# Altium schematic sheet LM-CT-001.SchDoc
size Tabloid
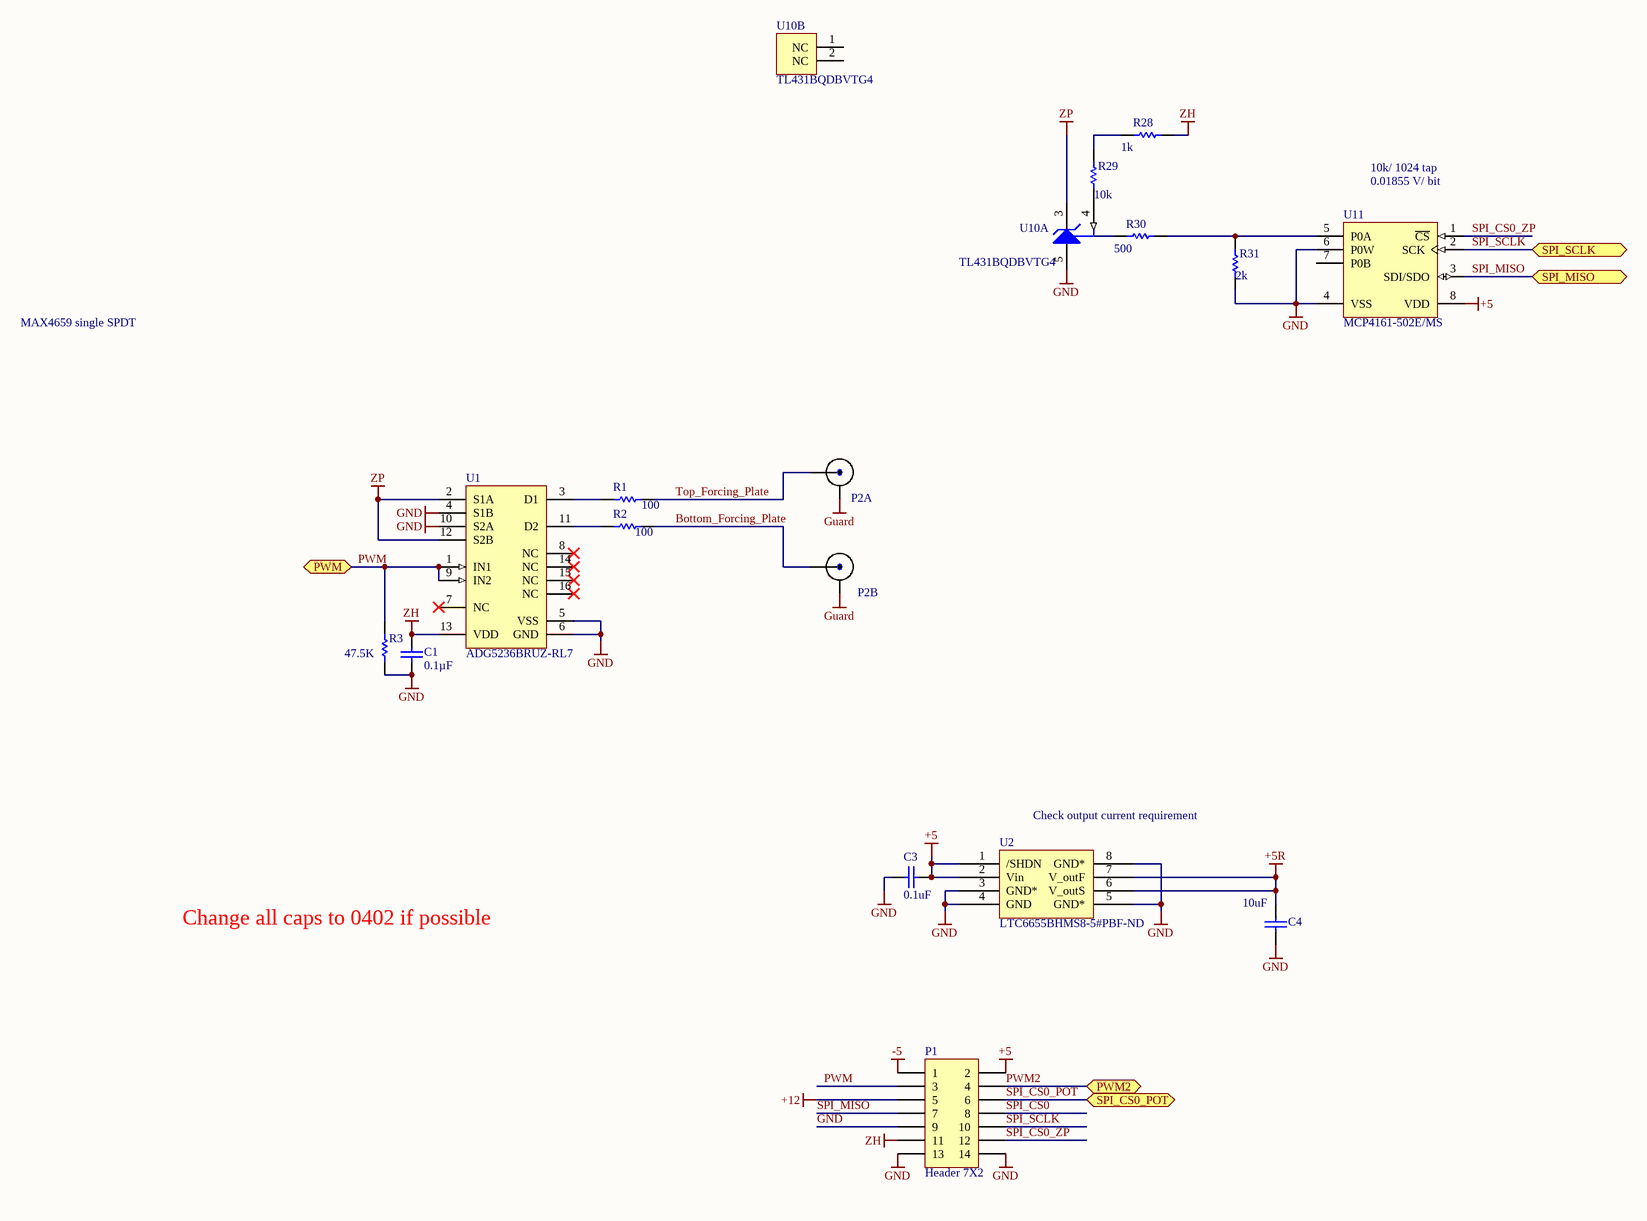
[diagram p0: LM-CT-001.SchDoc]

## Parts
C1  Capacitance: 0.1µF  [CAPC0805(2012)145_N]  (hidden comment: CAP CER 0.1UF 25V X7R 0805)
C3  0.1uF  [CAPC0402(1005)60_L]
C4  value 10uF  [CAPC1812(4532)250_N]  (hidden comment: CAP FILM 10UF 20% 16VDC 1812)
P1  Header 7X2  [FTSH-107-01-F-D-K]
P2  GRF1-P-P-04-E-ST-TH1  [GRF1-P-P-04-E-ST-TH1]  (value not drawn)  (parts A,B of 4)
R1  100  [RESC0402(1005)_M]
R2  100  [RESC0402(1005)_M]
R3  47.5K  [RESC0402(1005)_M]
R28  1k  [RESC0402(1005)_M]
R29  10k  [RESC0402(1005)_M]
R30  500  [RESC0402(1005)_M]
R31  2k  [RESC0402(1005)_M]
U1  ADG5236BRUZ-RL7  [ADI-RU-16_L]
U2  Supplier Part Number 1: LTC6655BHMS8-5#PBF-ND  [TSOP65P490X110-8N]  (hidden comment: LTC6655BHMS8-5#PBF)
U10  TL431BQDBVTG4  [TI-DBV5_N]  (parts A,B of 2)
U11  MCP4161-502E/MS  [MSOP-MS8_N]

## Ports
PWM, PWM2, SPI_CS0_POT, SPI_MISO, SPI_SCLK

## Nets
+5: C3.2 P1.2 U2.1(/SHDN) U2.2(Vin) U11.8(VDD)
+5R: C4.2 U2.6(V_outS) U2.7(V_outF)
+12: P1.5
-5: P1.1
GND: C1.1 C3.1 C4.1 P1.9 P1.13 P1.14 R3.2 R31.2 U1.4(S1B) U1.5(VSS) U1.6(GND) U1.10(S2A) U2.3(GND*) U2.4(GND) U2.5(GND*) U2.8(GND*) U10.5(ANODE) U11.4(VSS) U11.6(P0W)
Guard: P2.7 P2.8
ZH: C1.2 P1.11 R28.2 U1.13(VDD)
ZP: U1.2(S1A) U1.12(S2B) U10.3(CATHODE)
Bottom_Forcing_Plate: P2.2 R2.1
PWM: P1.3 R3.1 U1.1(IN1) U1.9(IN2) ; port PWM
PWM2: P1.4 ; port PWM2
SPI_CS0: P1.8
SPI_CS0_POT: P1.6 ; port SPI_CS0_POT
SPI_CS0_ZP: P1.12 U11.1(~{CS})
SPI_MISO: P1.7 U11.3(SDI/SDO) ; port SPI_MISO
SPI_SCLK: P1.10 U11.2(SCK) ; port SPI_SCLK
Top_Forcing_Plate: P2.1 R1.1
NetR1_2: R1.2 U1.3(D1)
NetR2_2: R2.2 U1.11(D2)
NetR28_1: R28.1 R29.1
NetR29_2: R29.2 U10.4(REF)
NetR30_2: R30.2 R31.1 U11.5(P0A)

Not connected (* = marked no-connect by the designer): R30 1; U1 7(NC)* 8(NC)* 14(NC)* 15(NC)* 16(NC)*; U10 1(NC) 2(NC); U11 7(P0B)

## Notes on the sheet
- 10k/ 1024 tap
- (near U11) 0.01855 V/ bit
- MAX4659 single SPDT
- (near U2) Check output current requirement
- Change all caps to 0402 if possible
- Title
- Size:
- Date:
- Tabloid
- Number:
- Time:
- Revision:
- Sheet
- of
- ZLS Corporation
- 7801 North Lamar Blvd.
- Suite E-184
- Austin, Texas 78752  USA
- (512) 453-0288
- File:

## Library data of the parts
C1 = CMP-1036-04795-1: Manufacturer: Murata Electronics North America; Manufacturer Part Number: GRM21BR71E104KA01L; Tolerance: ±10%; Supplier 1: Digi-Key; Supplier Part Number 1: 490-1673-6-ND; RoHS: RoHS Compliant; Category: Capacitors; Stock 1: 891652; Pricing 1: 1=0.2, 10=0.145, 100=0.0683, 500=0.04788, 1000=0.03964 (USD); Packaging: Digi-Reel®; Part Status: Active; Voltage - Rated: 25V; Temperature Coefficient: X7R; Operating Temperature: -55°C ~ 125°C; Features: -; Ratings: -; Applications: General Purpose; Mounting Type: Surface Mount, MLCC; Package / Case: 0805 (2012 Metric); Size / Dimension: 0.079" L x 0.049" W (2.00mm x 1.25mm); Height - Seated (Max): -; Thickness (Max): 0.053" (1.35mm); Lead Spacing: -; Lead Style: -; ComponentLink1URL: http://www.murata.com/~/media/webrenewal/support/library/catalog/products/capacitor/mlcc/c02e.ashx; ComponentLink1Description: http://www.murata.com/~/media/webrenewal/support/library/catalog/products/capacitor/mlcc/c02e.ashx
C3 = CMP-1034-00252-1: CAP CER 0.1UF 10V X7R 0402; Manufacturer: Murata Electronics North America; Manufacturer Part Number: GRM155R71A104KA01D; Tolerance: ±10%; Supplier 1: Digi-Key; Supplier Part Number 1: 490-6321-1-ND; RoHS: RoHS Compliant; Category: Capacitors; Stock 1: 2920395; Pricing 1: 1=0.1, 10=0.014, 100=0.0063, 500=0.00446, 1000=0.00351, 2500=0.00319, 5000=0.00293 (USD); Packaging: Cut Tape (CT); Part Status: Active; Voltage - Rated: 10V; Temperature Coefficient: X7R; Operating Temperature: -55°C ~ 125°C; Features: -; Ratings: -; Applications: General Purpose; Mounting Type: Surface Mount, MLCC; Package / Case: 0402 (1005 Metric); Size / Dimension: 0.039" L x 0.020" W (1.00mm x 0.50mm); Height - Seated (Max): -; Thickness (Max): 0.022" (0.55mm); Lead Spacing: -; ComponentLink1URL: http://www.murata.com/~/media/webrenewal/support/library/catalog/products/capacitor/mlcc/c02e.ashx?la=en-us; ComponentLink1Description: http://www.murata.com/~/media/webrenewal/support/library/catalog/products/capacitor/mlcc/c02e.ashx?la=en-us
C4 = CMP-1040-01653-1: Manufacturer: Rubycon; Manufacturer Part Number: 16ST106MC44532; Rated Voltage: 16 V; Case-Metric: 4532; Case-EIA: 1812; Tolerance: Â±10%; Voltage Rating - DC: 16V; Dielectric Material: Acrylic, Metallized; Technology: SMT; Max Thickness: 2.5 mm; Supplier 1: Digi-Key; Supplier Part Number 1: 1189-1792-1-ND; RoHS: RoHS Compliant; Category: Capacitors; Stock 1: 1994; Pricing 1: 1=7.05, 10=6.263, 100=5.0105 (USD); Packaging: Cut Tape (CT); Part Status: Active; Voltage Rating - AC: -; Operating Temperature: -55°C ~ 125°C; Mounting Type: Surface Mount; Package / Case: 1812 (4532 Metric); Size / Dimension: 0.177" L x 0.126" W (4.50mm x 3.20mm); Height - Seated (Max): 0.102" (2.60mm); Lead Spacing: -; Applications: DC Link, DC Filtering; Features: -; ComponentLink1URL: http://www.rubycon.co.jp/en/catalog/e_pdfs/pmlcap/e_ST.pdf; ComponentLink1Description: http://www.rubycon.co.jp/en/catalog/e_pdfs/pmlcap/e_ST.pdf
P1 = Header 7X2: Header, 7-Pin, Dual row; LatestRevisionDate: 17-Jul-2002; LatestRevisionNote: Re-released for DXP Platform.; Publisher: Altium Limited
R1-R3 R28-R31 = CMP-1011-00463-1
U1 = CMP-0794-00019-1: High Voltage Latch-Up Proof, Dual SPDT Switches, 160 Ohm Ron, 16-pin SOP (RU-16), Reel; Manufacturer: Analog Devices; Max Pos Supply: +40V; # Sw Functions: 2; Max Neg Supply: -22V; t ON: 170ns, 150ns, 275ns, 170ns; Ron (ohms): 160, 140, 350, 150; Configuration: SPDT; PackageVersion: Nov-02; ComponentLink1Description: Manufacturer URL; ComponentLink3URL: http:/www.analog.com/static/imported-files/packages/36244347913743854010197452789RU16.pdf; PartNumber: ADG5236BRUZ-RL7; ComponentLink3Description: Package Specification; Code_JEDEC: MO-153AB; ComponentLink2Description: Datasheet; ComponentLink1URL: http://www.analog.com/en/index.html; ComponentLink2URL: http://www.analog.com/static/imported-files/data_sheets/ADG5236.pdf; Mounting Technology: Surface Mount; PackageDescription: 16-Pin Thin Shrink Small Outline Package, Body 5 x 4.4 mm, Pitch 0.65 mm; Packing: Reel; DatasheetVersion: Rev. A; PackageReference: RU-16
U2 = LTC6655BHMS8-5#PBF: Manufacturer: Linear Technology; Reference Type: Series; Output Type: Fixed; Voltage - Output (Min/Fixed): 5V; Tolerance: ±0.025%; Temperature Coefficient: 2ppm/°C; Noise - 0.1Hz to 10Hz: 0.25ppmp-p; Voltage - Input: 5.5 V ~ 13.2 V; Current - Supply: 7.5mA; Supplier 1: Digi-Key; Manufacturer Part Number: LTC6655BHMS8-5#PBF; RoHS: RoHS Compliant; Category: Integrated Circuits (ICs); Stock 1: 872; Pricing 1: 1=12.29, 25=8.158, 100=6.7 (USD); Packaging: Tube; Part Status: Active; Noise - 10Hz to 10kHz: -; Operating Temperature: -40°C ~ 125°C (TA); Mounting Type: Surface Mount; Package / Case: 8-TSSOP, 8-MSOP (0.118", 3.00mm Width); Supplier Device Package: 8-MSOP; ComponentLink1URL: http://www.linear.com/docs/28576; ComponentLink1Description: http://www.linear.com/docs/28576
U10 = CMP-0366-00713-1: Adjustable Precision Shunt Regulator, 34 ppm / degC, 100 mA, -40 to 125 degC, 5-pin SOT-23 (DBV), Green (RoHS & no Sb/Br); Manufacturer: Texas Instruments; Initial Accuracy @ 25/deg C(%): 0.5; Min Iz for Regulation(uA): 600; VO Adj(Max)(V): 36; Rating: Catalog; Temp Coeff(Typ)(ppm/ degree C): 34; VO Adj(Min)(V): 2.495; Iout/Iz(Max)(mA): 100; SubFamily: Shunt Voltage Reference; Temp Coeff(Max)(ppm/ degree C): 92; ComponentLink3Description: Package Specification; Eco-Plan: Green (RoHS & no Sb/Br); ComponentLink3URL: http://www.ti.com/litv/pdf/mpds018i; PackageDescription: 5-Pin Plastic Small Outline, Body 1.60 Ã— 2.90 mm, Pitch 0.95 mm; Mounting Technology: Surface Mount; ComponentLink2Description: Datasheet; ComponentLink1Description: Manufacturer URL; PackageVersion: 4073253-4/K; ComponentLink2URL: http://www.ti.com/general/docs/lit/getliterature.tsp?genericPartNumber=TL431B&fileType=pdf; DatasheetVersion: SLVS543M; PartNumber: TL431BQDBVTG4; ComponentLink1URL: http://www.ti.com/; Code_JEDEC: MO-178; PackageReference: DBV5; PartId: 1
U11 = CMP-0188-00907-2: 7/8-Bit Single/Dual SPI Digital POT with Non-Volatile Memory, 8-Pin MSOP, Extended Temperature; ComponentLink2Description: Datasheet; PackageDescription: 8-Lead Plastic Micro Small Outline Package (MS) [MSOP]; PackageVersion: revBB, Aug-2009; PackageReference: MSOP-MS8; ComponentLink1Description: Manufacturer URL; ComponentLink3URL: http://www.microchip.com/stellent/groups/techpub_sg/documents/packagingspec/en012702.pdf; DatasheetVersion: revB, Dec-2008; ComponentLink3Description: Package Specification; ComponentLink1URL: http://www.microchip.com/; RevisionNote: URLs added.; ComponentLink2URL: http://ww1.microchip.com/downloads/en/DeviceDoc/22059b.pdf